# EAGLE schematic control v1 (EAGLE 6.1)

## Sheet 1 of 6
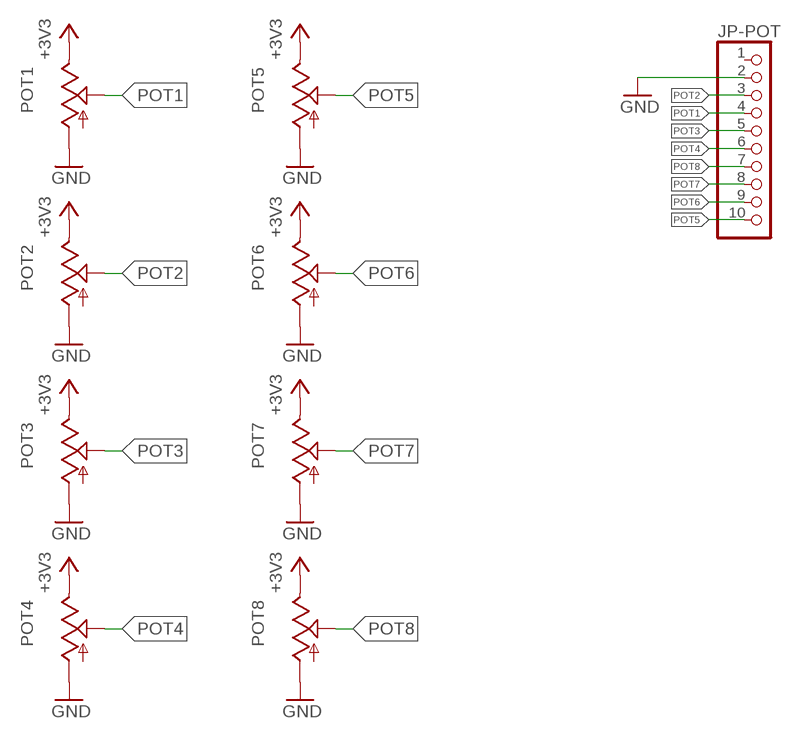
[diagram p0: schematic, sheet 1]

### Parts
JP-POT  PINHD-1X10_2.54  [1X10]
POT1  9MM_SNAP-IN_POT_  [9MM_SNAP-IN_POT]
POT2  9MM_SNAP-IN_POT_  [9MM_SNAP-IN_POT]
POT3  9MM_SNAP-IN_POT_  [9MM_SNAP-IN_POT]
POT4  9MM_SNAP-IN_POT_  [9MM_SNAP-IN_POT]
POT5  9MM_SNAP-IN_POT_  [9MM_SNAP-IN_POT]
POT6  9MM_SNAP-IN_POT_  [9MM_SNAP-IN_POT]
POT7  9MM_SNAP-IN_POT_  [9MM_SNAP-IN_POT]
POT8  9MM_SNAP-IN_POT_  [9MM_SNAP-IN_POT]

### Nets
+3V3: POT1.3(E) POT2.3(E) POT3.3(E) POT4.3(E) POT5.3(E) POT6.3(E) POT7.3(E) POT8.3(E) ; also sheet 6
GND: JP-POT.2 POT1.1(A) POT2.1(A) POT3.1(A) POT4.1(A) POT5.1(A) POT6.1(A) POT7.1(A) POT8.1(A) ; also sheet 2,3,4,5,6
POT1: JP-POT.4 POT1.2(S)
POT2: JP-POT.3 POT2.2(S)
POT3: JP-POT.5 POT3.2(S)
POT4: JP-POT.6 POT4.2(S)
POT5: JP-POT.10 POT5.2(S)
POT6: JP-POT.9 POT6.2(S)
POT7: JP-POT.8 POT7.2(S)
POT8: JP-POT.7 POT8.2(S)
Unconnected: JP-POT.1

## Sheet 2 of 6
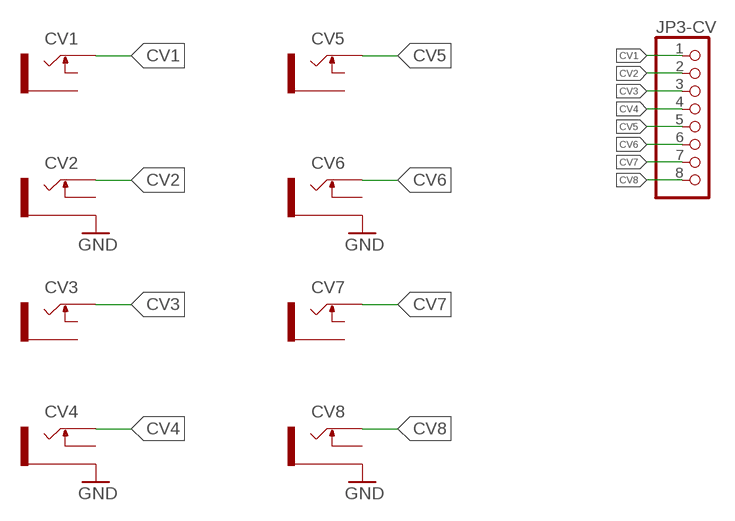
[diagram p1: schematic, sheet 2]

### Parts
CV1  THONKICONNNEW  [WQP-PJ301M-12_JACK]
CV2  THONKICONNNEW  [WQP-PJ301M-12_JACK]
CV3  THONKICONNNEW  [WQP-PJ301M-12_JACK]
CV4  THONKICONNNEW  [WQP-PJ301M-12_JACK]
CV5  THONKICONNNEW  [WQP-PJ301M-12_JACK]
CV6  THONKICONNNEW  [WQP-PJ301M-12_JACK]
CV7  THONKICONNNEW  [WQP-PJ301M-12_JACK]
CV8  THONKICONNNEW  [WQP-PJ301M-12_JACK]
JP3-CV  PINHD-1X8  [1X08]

### Nets
CV1: CV1.P$1_TIP(TIP) JP3-CV.1
CV2: CV2.P$1_TIP(TIP) JP3-CV.2
CV3: CV3.P$1_TIP(TIP) JP3-CV.3
CV4: CV4.P$1_TIP(TIP) JP3-CV.4
CV5: CV5.P$1_TIP(TIP) JP3-CV.5
CV6: CV6.P$1_TIP(TIP) JP3-CV.6
CV7: CV7.P$1_TIP(TIP) JP3-CV.7
CV8: CV8.P$1_TIP(TIP) JP3-CV.8
GND: CV2.P$3_SLEEVE(SLEEVE) CV4.P$3_SLEEVE(SLEEVE) CV6.P$3_SLEEVE(SLEEVE) CV8.P$3_SLEEVE(SLEEVE) ; also sheet 1,3,4,5,6
Unconnected: CV2.P$2_SWITCH(SWITCH) CV4.P$2_SWITCH(SWITCH) CV6.P$2_SWITCH(SWITCH) CV8.P$2_SWITCH(SWITCH)

## Sheet 3 of 6
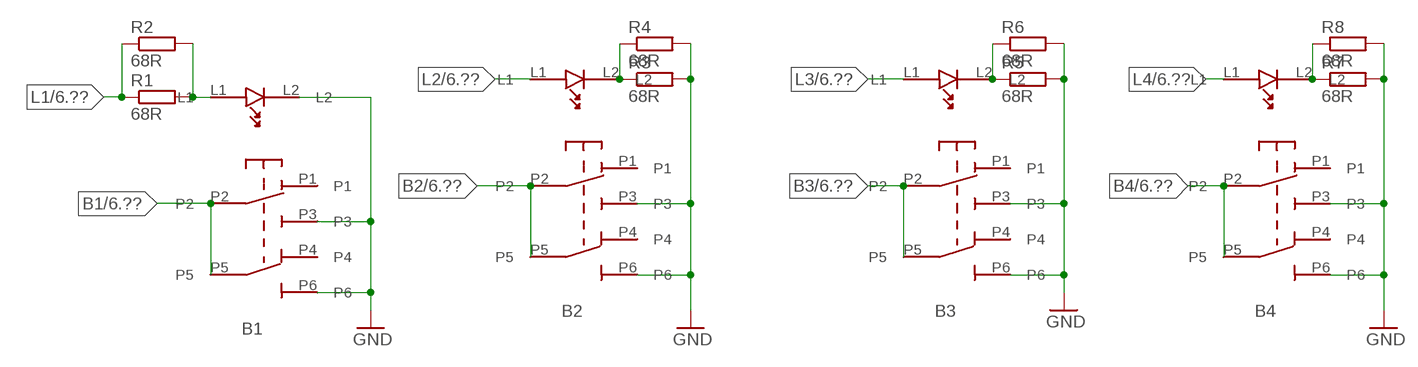
[diagram p2: schematic, sheet 3]

### Parts
B1  LP4OA1PBCTG  [LP4OA1PBCT]
B2  LP4OA1PBCTG  [LP4OA1PBCT]
B3  LP4OA1PBCTG  [LP4OA1PBCT]
B4  LP4OA1PBCTG  [LP4OA1PBCT]
R1  68R  R-EU_0207/7  [0207/7]
R2  68R  R-EU_0207/7  [0207/7]
R3  68R  R-EU_0207/7  [0207/7]
R4  68R  R-EU_0207/7  [0207/7]
R5  68R  R-EU_0207/7  [0207/7]
R6  68R  R-EU_0207/7  [0207/7]
R7  68R  R-EU_0207/7  [0207/7]
R8  68R  R-EU_0207/7  [0207/7]

### Nets
B1: B1.P2 B1.P5 ; also sheet 6
B2: B2.P2 B2.P5 ; also sheet 6
B3: B3.P2 B3.P5 ; also sheet 6
B4: B4.P2 B4.P5 ; also sheet 6
GND: B1.L2 B1.P3 B1.P6 B2.P3 B2.P6 B3.P3 B3.P6 B4.P3 B4.P6 R3.2 R4.2 R5.2 R6.2 R7.2 R8.2 ; also sheet 1,2,4,5,6
L1: R1.1 R2.1 ; also sheet 6
L2: B2.L1 ; also sheet 6
L3: B3.L1 ; also sheet 6
L4: B4.L1 ; also sheet 6
N$3: B2.L2 R3.1 R4.1
N$4: B3.L2 R5.1 R6.1
N$5: B1.L1 R1.2 R2.2
N$6: B4.L2 R7.1 R8.1
Unconnected: B1.P1 B1.P4 B2.P1 B2.P4 B3.P1 B3.P4 B4.P1 B4.P4

## Sheet 4 of 6
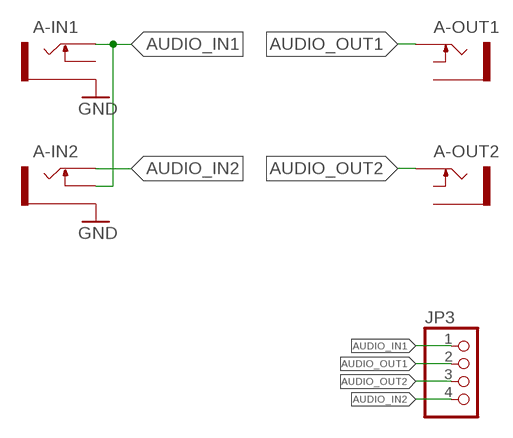
[diagram p3: schematic, sheet 4]

### Parts
A-IN1  THONKICONNNEW  [WQP-PJ301M-12_JACK]
A-IN2  THONKICONNNEW  [WQP-PJ301M-12_JACK]
A-OUT1  THONKICONNNEW  [WQP-PJ301M-12_JACK]
A-OUT2  THONKICONNNEW  [WQP-PJ301M-12_JACK]
JP3  PINHD-1X4  [1X04]

### Nets
AUDIO_IN1: A-IN1.P$1_TIP(TIP) A-IN2.P$2_SWITCH(SWITCH) JP3.1
AUDIO_IN2: A-IN2.P$1_TIP(TIP) JP3.4
AUDIO_OUT1: A-OUT1.P$1_TIP(TIP) JP3.2
AUDIO_OUT2: A-OUT2.P$1_TIP(TIP) JP3.3
GND: A-IN1.P$3_SLEEVE(SLEEVE) A-IN2.P$3_SLEEVE(SLEEVE) ; also sheet 1,2,3,5,6
Unconnected: A-IN1.P$2_SWITCH(SWITCH)

## Sheet 5 of 6
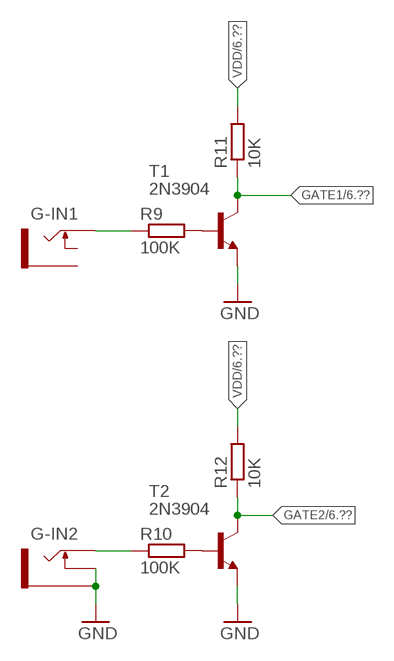
[diagram p4: schematic, sheet 5]

### Parts
G-IN1  THONKICONNNEW  [WQP-PJ301M-12_JACK]
G-IN2  THONKICONNNEW  [WQP-PJ301M-12_JACK]
R9  100K  R-EU_0207/7  [0207/7]
R10  100K  R-EU_0207/7  [0207/7]
R11  10K  R-EU_0207/7  [0207/7]
R12  10K  R-EU_0207/7  [0207/7]
T1  2N3904  [TO92]
T2  2N3904  [TO92]

### Nets
GATE1: R11.1 T1.1(C) ; also sheet 6
GATE2: R12.1 T2.1(C) ; also sheet 6
GND: G-IN2.P$2_SWITCH(SWITCH) G-IN2.P$3_SLEEVE(SLEEVE) T1.3(E) T2.3(E) ; also sheet 1,2,3,4,6
N$7: G-IN1.P$1_TIP(TIP) R9.1
N$9: G-IN2.P$1_TIP(TIP) R10.1
N$11: R9.2 T1.2(B)
N$16: R10.2 T2.2(B)
VDD: R11.2 R12.2 ; also sheet 6

## Sheet 6 of 6
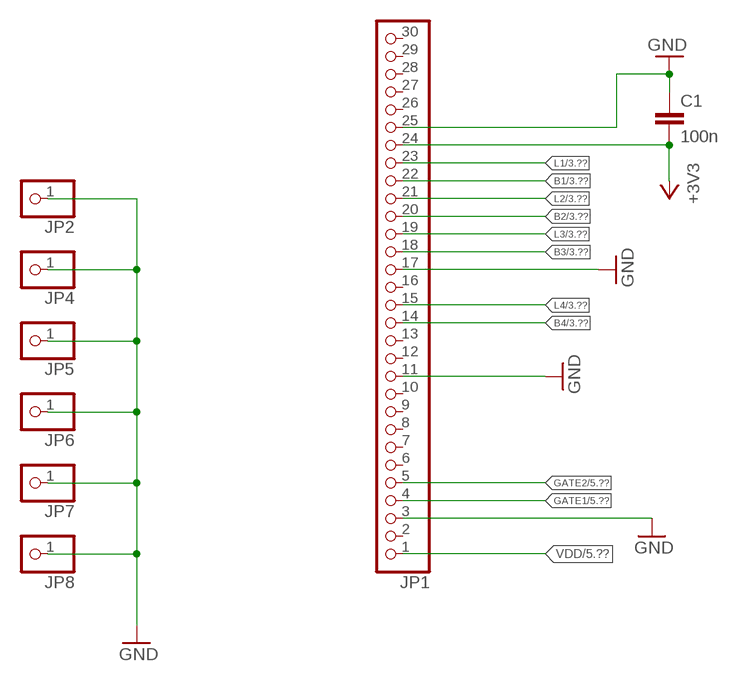
[diagram p5: schematic, sheet 6]

### Parts
C1  100n  C-EU025-025X050  [C025-025X050]
JP1  PINHD-1X30  [1X30]
JP2  PINHD-1X1  [1X01]
JP4  PINHD-1X1  [1X01]
JP5  PINHD-1X1  [1X01]
JP6  PINHD-1X1  [1X01]
JP7  PINHD-1X1  [1X01]
JP8  PINHD-1X1  [1X01]

### Nets
+3V3: C1.2 JP1.24 ; also sheet 1
B1: JP1.22 ; also sheet 3
B2: JP1.20 ; also sheet 3
B3: JP1.18 ; also sheet 3
B4: JP1.14 ; also sheet 3
GATE1: JP1.4 ; also sheet 5
GATE2: JP1.5 ; also sheet 5
GND: C1.1 JP1.3 JP1.11 JP1.17 JP1.25 JP2.1 JP4.1 JP5.1 JP6.1 JP7.1 JP8.1 ; also sheet 1,2,3,4,5
L1: JP1.23 ; also sheet 3
L2: JP1.21 ; also sheet 3
L3: JP1.19 ; also sheet 3
L4: JP1.15 ; also sheet 3
VDD: JP1.1 ; also sheet 5
Unconnected: JP1.2 JP1.6 JP1.7 JP1.8 JP1.9 JP1.10 JP1.12 JP1.13 JP1.16 JP1.26 JP1.27 JP1.28 JP1.29 JP1.30

## Library data of the parts
A-IN1 A-IN2 CV2 CV4 CV6 CV8 G-IN2 = MusicThingModular:THONKICONN: 3.5mm socket for Eurorack modular synths
A-OUT1 A-OUT2 CV1 CV3 CV5 CV7 G-IN1 = MusicThingModular mod:THONKICONN: 3.5mm socket for Eurorack modular synths
B1-B4 = og-switch:LP4OA1PBCTG
C1 = resistor-mod:C-EU: CAPACITOR, European symbol
JP1 = pinhead:PINHD-1X30: PIN HEADER
JP2 JP4-JP8 = pinhead:PINHD-1X1: PIN HEADER
JP3 = pinhead:PINHD-1X4: PIN HEADER
JP3-CV = pinhead:PINHD-1X8: PIN HEADER
JP-POT = pinhead 2:PINHD-1X10: PIN HEADER
POT1-POT8 = MusicThingModular:9MM_SNAP-IN_POT: 9mm vertical snap-in pot, Alpha / Panasonic style
R1-R12 = resistor-mod:R-EU_: RESISTOR, European symbol
T1 T2 = transistor:2N3904: NPN TRANSISTOR